# Altium schematic sheet Power.SchDoc
size A4; SheetNumber: 9; SheetTotal: 9
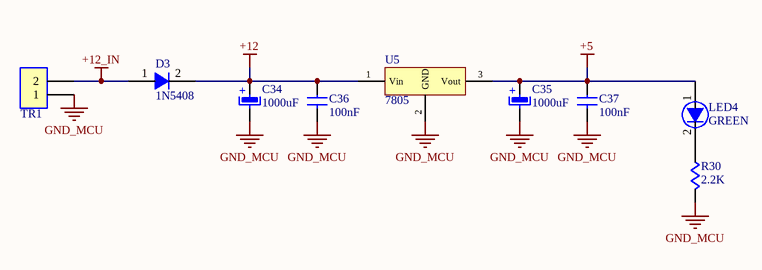
[diagram p0: Power.SchDoc]

## Parts
C34  value 1000uF  [CAP-Elec-10x25-5]  (hidden comment: CAP Elec 1000uF-25V-10x25-THD)
C35  value 1000uF  [CAP-Elec-6.3x12]  (hidden comment: CAP Elec 1000uF-10V-10x25-THD)
C36  value 100nF  [C-0805]  (hidden comment: CAP Cer 100nF-50V-X7R-SMD)
C37  value 100nF  [C-0805]  (hidden comment: CAP Cer 100nF-50V-X7R-SMD)
D3  Code: 1N5408  [D-DO214]  (hidden comment: Diode 1N5408-SMD)
LED4  Color: GREEN  [LED-1206-Y]  (hidden comment: LED GREEN-1206-SMD)
R30  value 2.2K  [R-0805]  (hidden comment: RES 2.2K-5%-1/8W-SMD)
TR1  Terminal KF301-2Pin-5.08mm-Straight  [KF301-2pin]  (value not drawn)
U5  Code: 7805  [TO220-HEARSINK-1]  (hidden comment: Reg 7805-5V-THD)

## Nets
+5: C35.1 C37.1 LED4.1(A) U5.3(Vout)
+12: C34.1 C36.1 D3.2(C) U5.1(Vin)
+12_IN: D3.1(A) TR1.2
GND_MCU: C34.2 C35.2 C36.2 C37.2 R30.2 TR1.1 U5.2(GND)
NetLED4_2: LED4.2(C) R30.1

## Notes on the sheet
- (in symbol CAP-ELEC) +

## Library data of the parts
C34 = CAP-ELEC: CAPACITOR; Phone Number: 0915 8700 314; Voltage: 25V; Type: THD; Publisher: Mahdi Bagherzadeh; ComponentLink1Description: Linkedin; ComponentLink1URL: https://ir.linkedin.com/in/mahdi-bagherzade; Published Date: 9-15-2024; Size: 10x25
C35 = CAP-ELEC: CAPACITOR; Phone Number: 0915 8700 314; Voltage: 10V; Type: THD; Publisher: Mahdi Bagherzadeh; ComponentLink1Description: Linkedin; ComponentLink1URL: https://ir.linkedin.com/in/mahdi-bagherzade; Published Date: 9-15-2024; Size: 10x25
C36 C37 = CAP-CER: CAPACITOR; Phone Number: 0915 8700 314; Voltage: 50V; Tolerance: X7R; Type: SMD; Publisher: Mahdi Bagherzadeh; ComponentLink1Description: Linkedin; ComponentLink1URL: https://ir.linkedin.com/in/mahdi-bagherzade; Published Date: 9-15-2024
D3 = DIODE: Phone Number: 0915 8700 314; Type: SMD; Publisher: Mahdi Bagherzadeh; ComponentLink1Description: Linkedin; ComponentLink1URL: https://ir.linkedin.com/in/mahdi-bagherzade; Published Date: 9-15-2024
LED4 = LED: Phone Number: 0915 8700 314; Type: SMD; Publisher: Mahdi Bagherzadeh; ComponentLink1Description: Linkedin; ComponentLink1URL: https://ir.linkedin.com/in/mahdi-bagherzade; Published Date: 9-15-2024; Size: 1206
R30 = RES: RESISTOR; Phone Number: 0915 8700 314; Tolerance: 5%; Power: 1/8W; Publisher: Mahdi Bagherzadeh; ComponentLink1Description: Linkedin; ComponentLink1URL: https://ir.linkedin.com/in/mahdi-bagherzade; Published Date: 9-15-2024; Type: SMD
TR1 = TEMINAL-2pin: TERMINAL; Phone Number: 0915 8700 314; Publisher: Mahdi Bagherzadeh; ComponentLink1Description: Linkedin; ComponentLink1URL: https://ir.linkedin.com/in/mahdi-bagherzade; Published Date: 9-15-2024; Size: 5.08mm; Code: KF301-2Pin; Type: Straight
U5 = 78Mxx: REGULATOR; Phone Number: 0915 8700 314; Voltage: 5V; Publisher: Mahdi Bagherzadeh; ComponentLink1Description: Linkedin; ComponentLink1URL: https://ir.linkedin.com/in/mahdi-bagherzade; Published Date: 9-15-2024; Type: THD